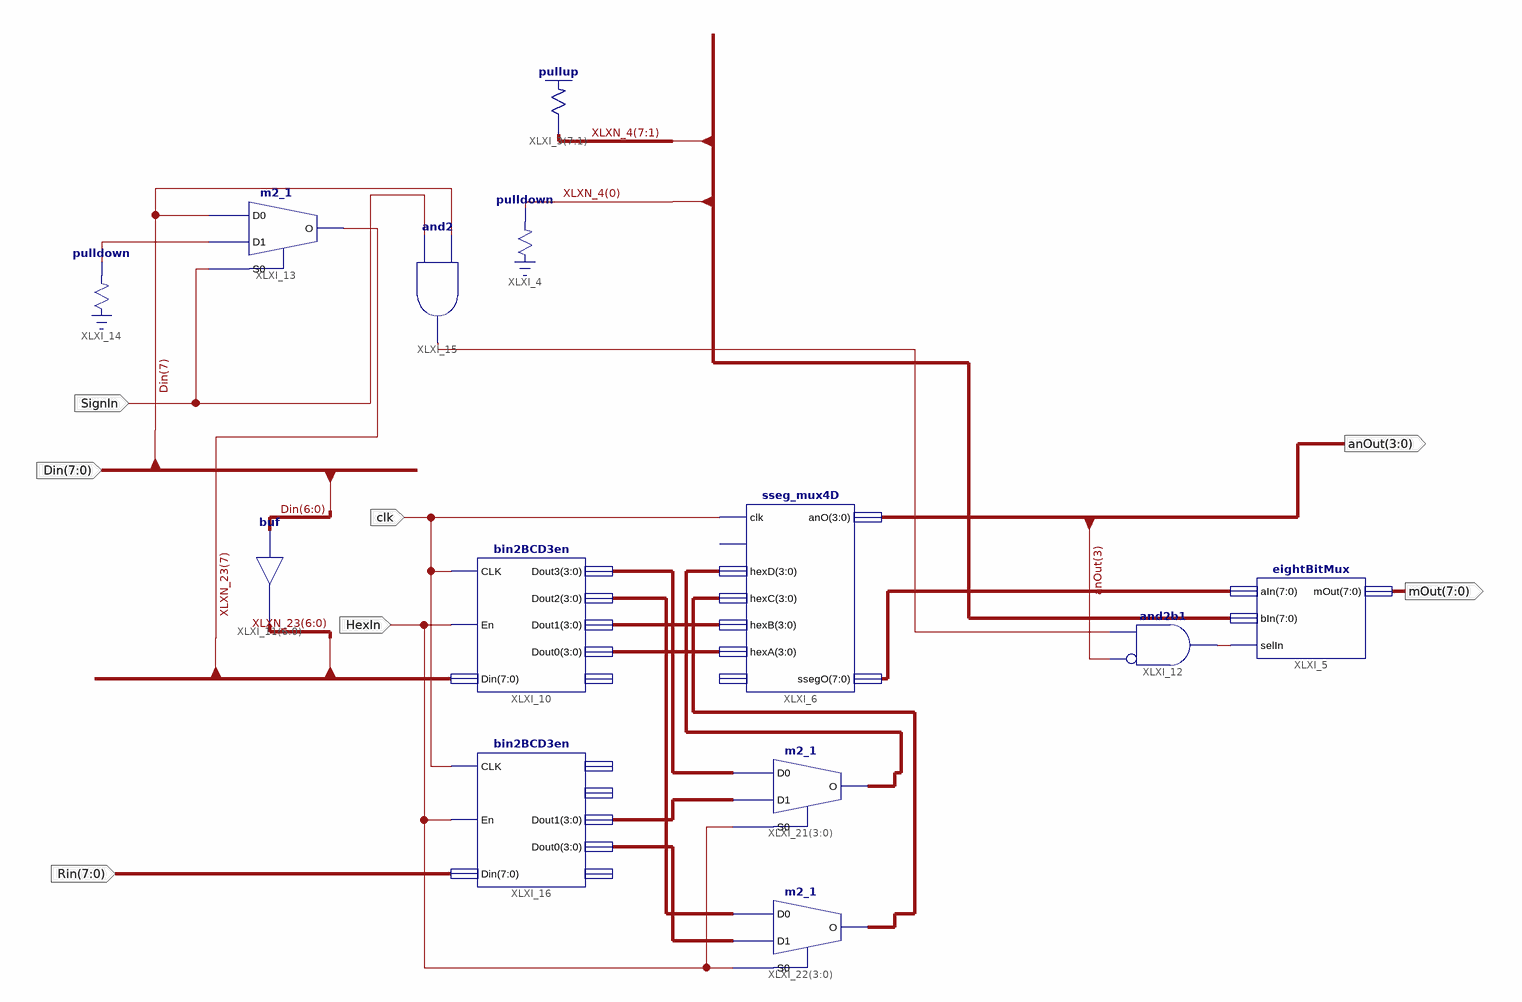
[diagram p0: schematic sheet 1]
// Xilinx ISE schematic NegSeg.sch (spartan3e) as structural Verilog: 13 symbols, 7 ports
module NegSeg (
  input  SignIn,
  input  clk,
  input  [7:0] Din,
  input  HexIn,
  input  [7:0] Rin,
  output [3:0] anOut,
  output [7:0] mOut
);

  wire XLXN_11, XLXN_37, XLXN_40;
  wire [3:0] hexA, hexB, XLXN_47, XLXN_48, XLXN_49, XLXN_50, XLXN_53, XLXN_54;
  wire [7:0] XLXN_1, XLXN_4, XLXN_23;

  \pullup  XLXI_3[7:1] (.O(XLXN_4[7:1]));
  \pulldown  XLXI_4 (.O(XLXN_4[0]));
  eightBitMux XLXI_5 (.aIn(XLXN_1), .bIn(XLXN_4), .selIn(XLXN_11), .mOut(mOut));
  sseg_mux4D XLXI_6 (
    .clk(clk), .hexD(XLXN_53), .hexC(XLXN_54), .hexB(hexB), .hexA(hexA), .anO(anOut), .ssegO(XLXN_1));  // open: rb_in, dp_in
  bin2BCD3en XLXI_10 (
    .CLK(clk), .En(HexIn), .Din(XLXN_23), .Dout3(XLXN_50), .Dout2(XLXN_49), .Dout1(hexB), .Dout0(hexA));  // open: RBout
  assign XLXN_23[6:0] = Din[6:0];  // buf XLXI_11[6..0], 7 bits wide
  and XLXI_12 (XLXN_11, ~anOut[3], XLXN_40);  // and2b1
  m2_1 XLXI_13 (.D0(Din[7]), .D1(XLXN_37), .S0(SignIn), .O(XLXN_23[7]));
  \pulldown  XLXI_14 (.O(XLXN_37));
  and XLXI_15 (XLXN_40, SignIn, Din[7]);
  bin2BCD3en XLXI_16 (.CLK(clk), .En(HexIn), .Din(Rin), .Dout1(XLXN_47), .Dout0(XLXN_48));  // open: Dout3, Dout2, RBout
  m2_1 XLXI_21[3:0] (.D0(XLXN_50), .D1(XLXN_47), .S0(HexIn), .O(XLXN_53));
  m2_1 XLXI_22[3:0] (.D0(XLXN_49), .D1(XLXN_48), .S0(HexIn), .O(XLXN_54));
endmodule
